# EAGLE design BitanicV2.5 (EAGLE 9.6.2)
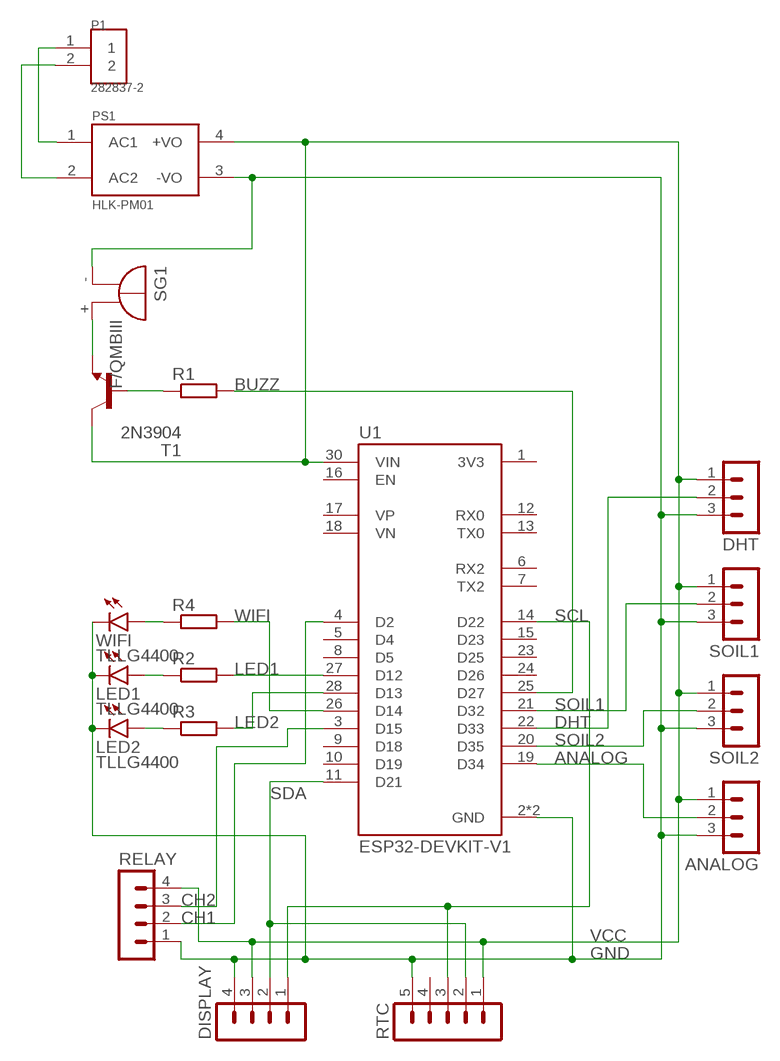
[diagram p0: schematic, sheet 1]

## Parts
ANALOG  MA03-1  [MA03-1]
DHT  MA03-1  [MA03-1]
DISPLAY  MA04-1  [MA04-1]
LED1  TLLG4400  [LED3MM]
LED2  TLLG4400  [LED3MM]
P1  282837-2  [TE_282837-2]
PS1  HLK-PM01  [CONV_HLK-PM01]
R1  R-EU_0309/12  [0309/12]
R2  R-EU_0309/12  [0309/12]
R3  R-EU_0309/12  [0309/12]
R4  R-EU_0309/12  [0309/12]
RELAY  MA04-1  [MA04-1]
RTC  MA05-1  [MA05-1]
SG1  F/QMBIII  [F/QMBIII]
SOIL1  MA03-1  [MA03-1]
SOIL2  MA03-1  [MA03-1]
T1  2N3904  [TO92]
U1  ESP32-DEVKIT-V1  [MODULE_ESP32_DEVKIT_V1]
WIFI  TLLG4400  [LED3MM]

## Nets
ANALOG: ANALOG.2 U1.19(D34)
BUZZ: R1.2 U1.25(D27)
CH1: RELAY.2 U1.4(D2)
CH2: RELAY.3 U1.3(D15)
DHT: DHT.2 U1.22(D33)
GND: ANALOG.3 DHT.3 DISPLAY.4 LED1.K(C) LED2.K(C) PS1.3(-VO) RELAY.1 RTC.5 SG1.-(+) SOIL1.3 SOIL2.3 U1.2(GND) U1.29(GND) WIFI.K(C)
LED1: R2.2 U1.27(D12)
LED2: R3.2 U1.28(D13)
N$1: P1.2 PS1.2(AC2)
N$2: P1.1 PS1.1(AC1)
N$3: LED2.A R3.1
N$4: LED1.A R2.1
N$6: R4.1 WIFI.A
N$8: R1.1 T1.2(B)
N$10: SG1.+(-) T1.3(E)
SCL: DISPLAY.1 RTC.3 U1.14(D22)
SDA: DISPLAY.2 RTC.2 U1.11(D21)
SOIL1: SOIL1.2 U1.21(D32)
SOIL2: SOIL2.2 U1.20(D35)
VCC: ANALOG.1 DHT.1 DISPLAY.3 PS1.4(+VO) RELAY.4 RTC.1 SOIL1.1 SOIL2.1 T1.1(C) U1.30(VIN)
WIFI: R4.2 U1.26(D14)
Unconnected: RTC.4 U1.1(3V3) U1.5(D4) U1.6(RX2) U1.7(TX2) U1.8(D5) U1.9(D18) U1.10(D19) U1.12(RX0) U1.13(TX0) U1.15(D23) U1.16(EN) U1.17(VP) U1.18(VN) U1.23(D25) U1.24(D26)

## Library data of the parts
ANALOG DHT SOIL1 SOIL2 = con-lstb:MA03-1: PIN HEADER; OC_FARNELL: unknown; OC_NEWARK: unknown
DISPLAY RELAY = con-lstb:MA04-1: PIN HEADER; OC_FARNELL: unknown; OC_NEWARK: unknown
LED1 LED2 WIFI = led:TLLG4400: Low Current (2mA) LED 3 mm Tinted Diffused Package color GREEN Source: Data sheet <http://www.farnell.com/datasheets/391098.pdf>; MF: VISHAY SEMICONDUCTOR; OC_FARNELL: 1612435
P1 = 282837-2:282837-2: TERM BLOCK 5.08MM 2POS SIDE ENTY Check availability <https://pricing.snapeda.com/parts/282837-2/TE%20Connectivity/view-part?ref=eda>; AVAILABILITY: In Stock; COMMENT: 282837-2; DESCRIPTION: Connector Terminal Blocks Receptacle 2 Position 5.08mm Solder Straight Thru-Hole 13.5A/Contact; MF: TE Connectivity; MP: 282837-2; PACKAGE: None; PRICE: None; PURCHASE-URL: https://pricing.snapeda.com/search/part/282837-2/?ref=eda
PS1 = HLK-PM01:HLK-PM01: Check availability <https://pricing.snapeda.com/parts/hlk-pm01/Hi-link/view-part?ref=eda>; AVAILABILITY: Not in stock; DESCRIPTION: The HLK-PM01 is a small size low cost AC to DC converter which can take in 110V/220V AC at 50/60 Hz and give 5V 3W output. The module is can be used in designs which run on 5V and needs to be powered form the AC mains.; MF: Hi-link; MP: hlk-pm01; PACKAGE: None; PRICE: None
R1-R4 = rcl:R-EU_: RESISTOR, European symbol; SPICEPREFIX: R
RTC = con-lstb:MA05-1: PIN HEADER; OC_FARNELL: unknown; OC_NEWARK: unknown
SG1 = buzzer:F/QMBIII: BUZZER Source: Buerklin; OC_FARNELL: unknown; OC_NEWARK: unknown
T1 = transistor:2N3904: NPN TRANSISTOR
U1 = ESP32-DEVKIT-V1:ESP32-DEVKIT-V1: Dual core, Wi-Fi: 2.4 GHz up to 150 Mbits/s,BLE (Bluetooth Low Energy) and legacy Bluetooth, 32 bits, Up to 240 MHz Check availability <https://pricing.snapeda.com/parts/ESP32-DEVKIT-V1/Do%20it/view-part?ref=eda>; AVAILABILITY: Not in stock; DESCRIPTION: Dual core, Wi-Fi: 2.4 GHz up to 150 Mbits/s,BLE (Bluetooth Low Energy) and legacy Bluetooth, 32 bits, Up to 240 MHz; MF: Do it; MP: ESP32-DEVKIT-V1; PACKAGE: None; PRICE: None

## Board
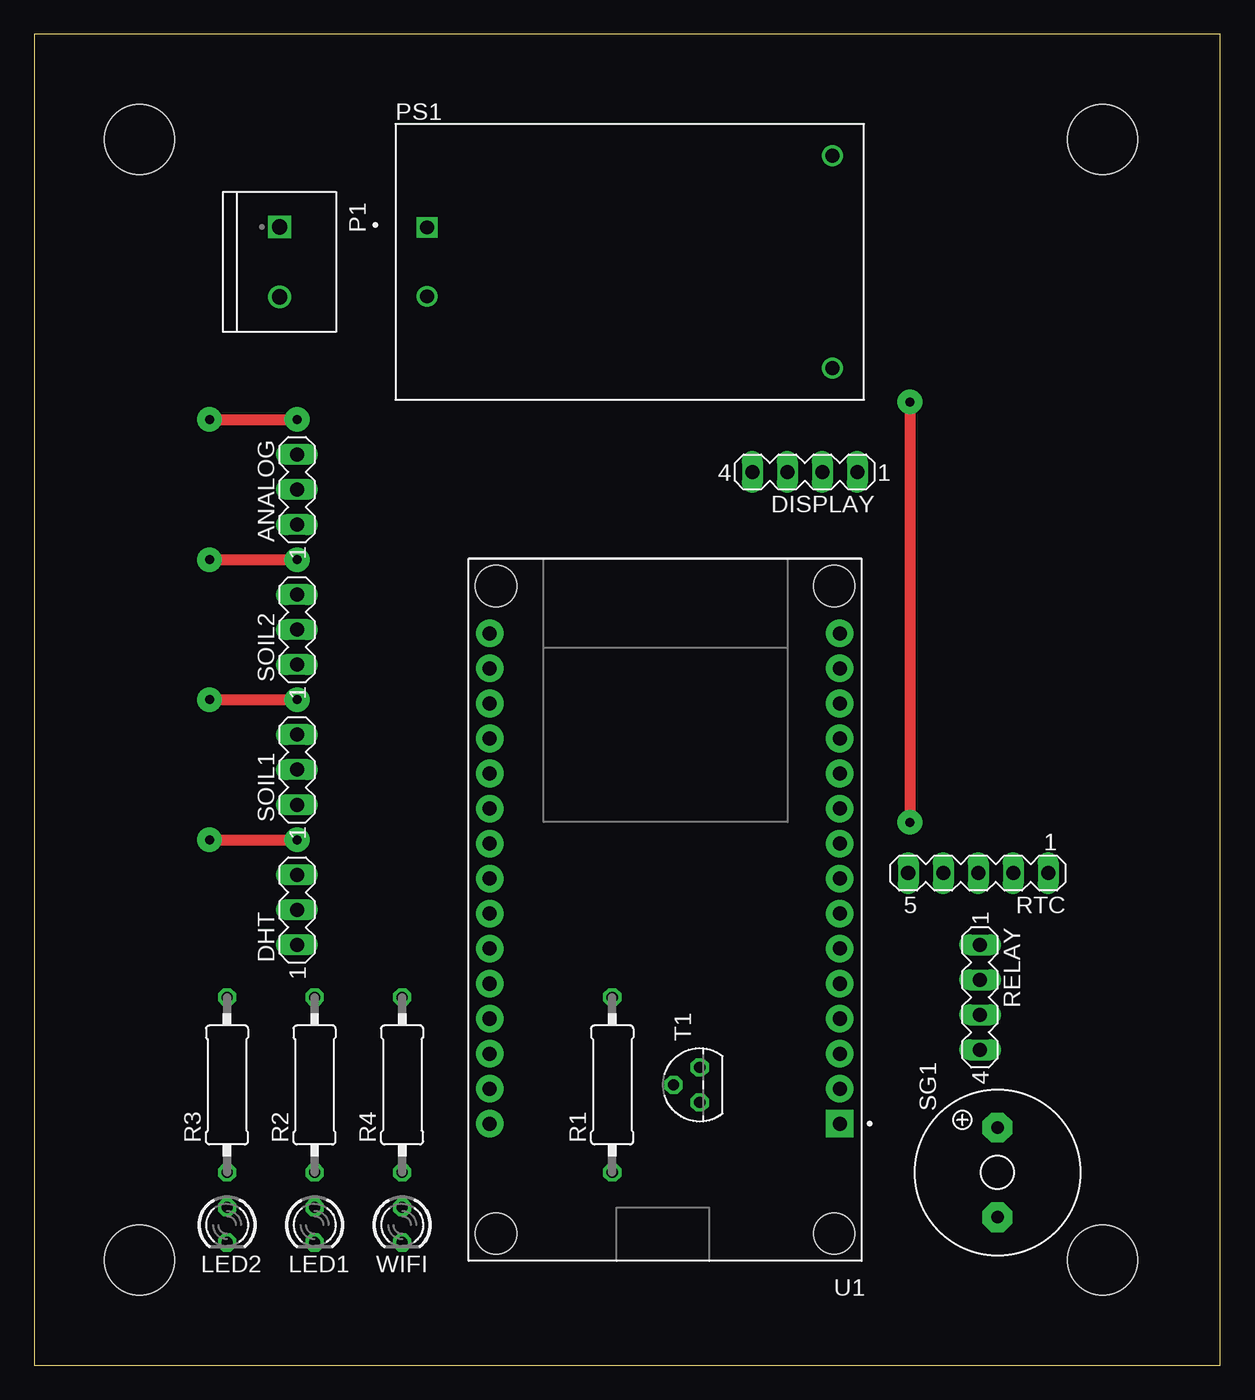
[diagram p1: board, top side]
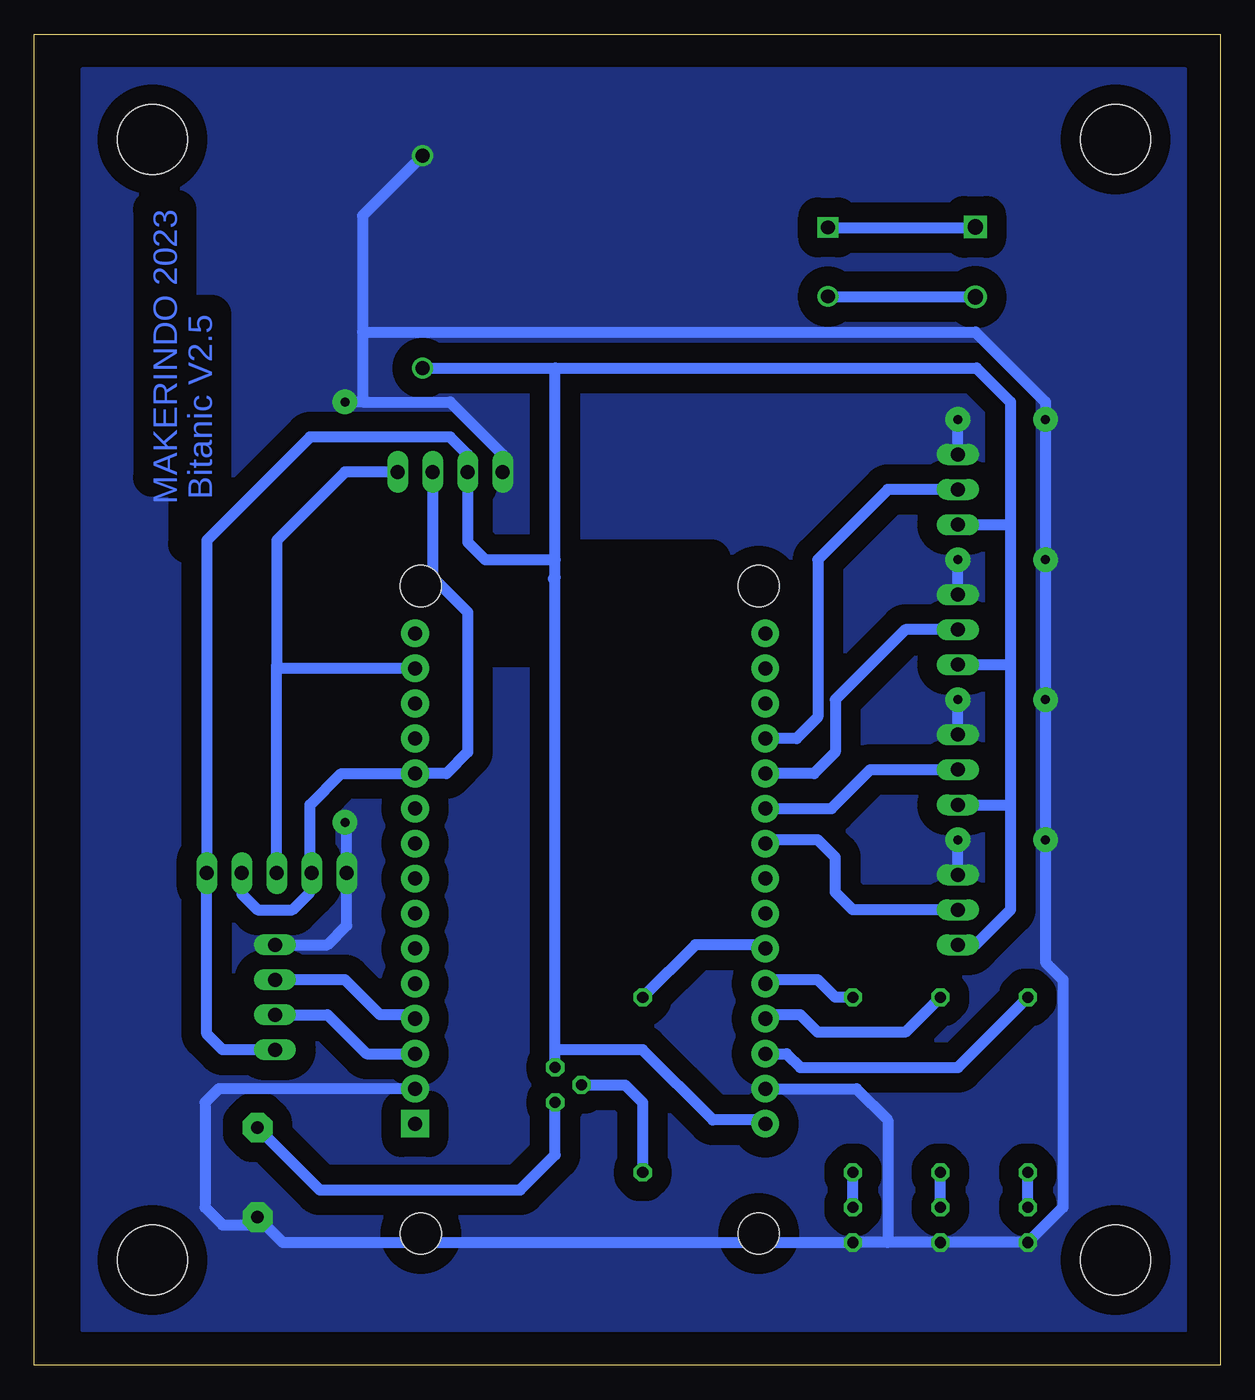
[diagram p2: board, bottom side, seen from below]

Size 86.03 x 96.51 mm. Coordinates in mm from the lower left corner, seen from the top.
Outline: 0,0 86.03,0 86.03,96.51 0,96.51 0,0
Copper layers (1*16): Top 0.035mm / dielectric 1.5mm / Bottom 0.035mm
Design rules "default": minimum track width 6mil, minimum drill 0.35mm, track to track 6mil, track to pad 6mil, pad to pad 6mil, via to via 6mil, smd to smd 6mil, copper to edge 40mil, drill to drill 6mil, minimum pad ring 10mil, minimum via ring 8mil, stop-mask expansion 4mil, vias tented up to drill 0mil, thermal gap 10mil
Holes 5.08 mm at 7.62,88.9 77.47,88.9 77.47,7.62 7.62,7.62

### Footprints (pad centres in the part's own frame; a part is rotated, then mirrored left to right if it is on the bottom)
MA03-1 = drill 1.016 long: 1 -2.54,0; 2 0,0; 3 2.54,0
MA04-1 = drill 1.016 long: 1 -3.81,0; 2 -1.27,0; 3 1.27,0; 4 3.81,0
LED3MM = drill 0.813 octagon: A -1.27,0; K 1.27,0
TE_282837-2 = drill 1.1 square: 1 -2.54,0 | drill 1.1: 2 2.54,0
CONV_HLK-PM01 = drill 1 square: 1 -14.7,2.5 | drill 1: 2 -14.7,-2.5; 3 14.7,7.7; 4 14.7,-7.7
0309/12 = drill 0.813 octagon: 1 -6.35,0; 2 6.35,0
MA05-1 = drill 1.016 long: 1 -5.08,0; 2 -2.54,0; 3 0,0; 4 2.54,0; 5 5.08,0
F/QMBIII = drill 0.914 pad 2.159 octagon: + 3.251,0; - -3.251,0
TO92 = drill 0.813 octagon: 1 1.27,0; 2 0,1.905; 3 -1.27,0
MODULE_ESP32_DEVKIT_V1 = drill 1.02 pad 2 square: 1 -12.7,15.515 | drill 1.02 pad 2: 2 -12.7,12.975; 3 -12.7,10.435; 4 -12.7,7.895; 5 -12.7,5.355; 6 -12.7,2.815; 7 -12.7,0.275; 8 -12.7,-2.265; 9 -12.7,-4.805; 10 -12.7,-7.345; 11 -12.7,-9.885; 12 -12.7,-12.425; 13 -12.7,-14.965; 14 -12.7,-17.505; 15 -12.7,-20.045; 16 12.7,-20.045; 17 12.7,-17.505; 18 12.7,-14.965; 19 12.7,-12.425; 20 12.7,-9.885; 21 12.7,-7.345; 22 12.7,-4.805; 23 12.7,-2.265; 24 12.7,0.275; 25 12.7,2.815; 26 12.7,5.355; 27 12.7,7.895; 28 12.7,10.435; 29 12.7,12.975; 30 12.7,15.515 | hole 3: -12.28,-23.475; 12.23,-23.475; 12.23,23.475; -12.28,23.475

### Placement (x,y rotation side)
ANALOG  19.05,63.5 90 top
DHT  19.05,33.02 90 top
DISPLAY  55.88,64.77 180 top
LED1  20.32,10.16 270 top
LED2  13.97,10.16 270 top
P1  17.78,80.01 270 top
PS1  43.18,80.01 0 top
R1  41.91,20.32 90 top
R2  20.32,20.32 90 top
R3  13.97,20.32 90 top
R4  26.67,20.32 90 top
RELAY  68.58,26.67 270 top
RTC  68.45,35.69 180 top
SG1  69.85,13.97 90 top
SOIL1  19.05,43.18 90 top
SOIL2  19.05,53.34 90 top
T1  48.26,20.32 90 top
U1  45.72,33.02 180 top
WIFI  26.67,10.16 270 top

### Tracks (layer width: path | path; a pad name or v marks a point on that pad's centre or on a via)
ANALOG
  Bottom 0.813: ANALOG.2 24.13,63.5 29.21,58.42 29.21,46.99 30.75,45.45 U1.19
BUZZ
  Bottom 0.813: U1.25 33.3,30.48 38.1,30.48 R1.2
CH1
  Bottom 0.813: U1.4 58.7,25.4 60.96,25.4 63.5,27.94 RELAY.2
CH2
  Bottom 0.813: RELAY.3 64.77,25.4 61.96,22.59 U1.3
DHT
  Bottom 0.813: DHT.2 26.67,33.02 27.94,34.29 27.94,36.83 29.21,38.1 32.74,38.1 U1.22
GND  (via drill 0.65 pad 1.78)
  Top 0.813: v12.7,38.1 v19.05,38.1 | v12.7,48.26 v19.05,48.26 | v12.7,58.42 v19.05,58.42 | v12.7,68.58 v19.05,68.58 | v63.5,69.85 v63.5,39.37
  Bottom 0.813: 24.13,8.89 LED1.K LED2.K 11.43,11.43 11.43,27.94 12.7,29.21 v12.7,38.1 v12.7,48.26 v12.7,58.42 v12.7,68.58 12.7,69.85 17.78,74.93 62.23,74.93 | 24.13,8.89 WIFI.K 68.02,8.89 SG1.- 70.41,10.16 72.39,10.16 73.66,11.43 73.66,19.05 72.67,20.05 U1.2 | U1.29 26.39,20.05 24.13,17.78 24.13,8.89 | DISPLAY.4 52.07,66.04 55.88,69.85 62.23,69.85 | RELAY.1 64.77,30.48 63.37,31.88 RTC.5 63.37,39.24 v63.5,39.37 | PS1.3 62.23,83.36 62.23,74.93 | 62.23,74.93 62.23,69.85 | DHT.3 v19.05,38.1 | SOIL1.3 v19.05,48.26 | SOIL2.3 v19.05,58.42 | ANALOG.3 v19.05,68.58 | 62.23,69.85 v63.5,69.85
  pour Bottom (isolate 1.422, no thermals): 2.54,93.98 82.55,93.98 82.55,2.54 2.54,2.54
LED1
  Bottom 0.813: R2.2 22.86,24.13 29.21,24.13 30.48,25.4 32.74,25.4 U1.27
LED2
  Bottom 0.813: U1.28 31.48,22.59 30.48,21.59 19.05,21.59 R3.2
N$1
  Bottom 0.813: PS1.2 17.82,77.51 P1.2
N$2
  Bottom 0.813: PS1.1 17.82,82.51 P1.1
N$3
  Bottom 0.813: LED2.A R3.1
N$4
  Bottom 0.813: LED1.A R2.1
N$6
  Bottom 0.813: WIFI.A R4.1
N$8
  Bottom 0.813: T1.2 43.18,20.32 41.91,19.05 R1.1
N$10
  Bottom 0.813: SG1.+ 65.33,12.7 50.8,12.7 48.26,15.24 T1.3
SCL
  Bottom 0.813: RTC.3 68.45,50.8 | DISPLAY.1 63.5,64.77 68.45,59.82 68.45,50.8 | 68.45,50.8 68.18,50.52 U1.14
SDA
  Bottom 0.813: RTC.2 70.99,34.16 69.85,33.02 67.31,33.02 66.04,34.29 66.04,40.64 63.77,42.91 U1.11 56.16,42.91 54.61,44.45 54.61,54.61 57.15,57.15 DISPLAY.2
SOIL1
  Bottom 0.813: U1.21 28.21,40.37 25.4,43.18 SOIL1.2
SOIL2
  Bottom 0.813: SOIL2.2 22.86,53.34 27.94,48.26 27.94,44.45 29.48,42.91 U1.20
VCC
  Bottom 0.813: PS1.4 48.26,72.31 | 48.26,72.31 17.7,72.31 15.24,69.85 15.24,60.96 | 15.24,60.96 15.24,50.8 | SOIL2.1 15.24,50.8 | 15.24,50.8 15.24,40.64 | 15.24,40.64 15.24,33.02 17.78,30.48 DHT.1 | T1.1 48.26,22.86 | 48.26,22.86 48.26,57.15 | 48.26,57.15 48.26,58.42 | 48.26,58.42 48.26,72.31 | U1.30 33.3,17.78 36.83,17.78 41.91,22.86 48.26,22.86 | 48.39,57.02 48.26,57.15 | 48.26,58.42 53.34,58.42 54.61,59.69 DISPLAY.3 54.61,66.04 55.88,67.31 66.04,67.31 73.53,59.82 RTC.1 73.53,24 72.39,22.86 RELAY.4 | ANALOG.1 15.24,60.96 | SOIL1.1 15.24,40.64
WIFI
  Bottom 0.813: R4.2 27.94,26.67 29.21,27.94 32.74,27.94 U1.26

### Text on the board
Bottom: MAKERINDO 2023 | Bitanic V2.5